# EAGLE design Gamepad Seesaw QT rev A (EAGLE 9.6.2)
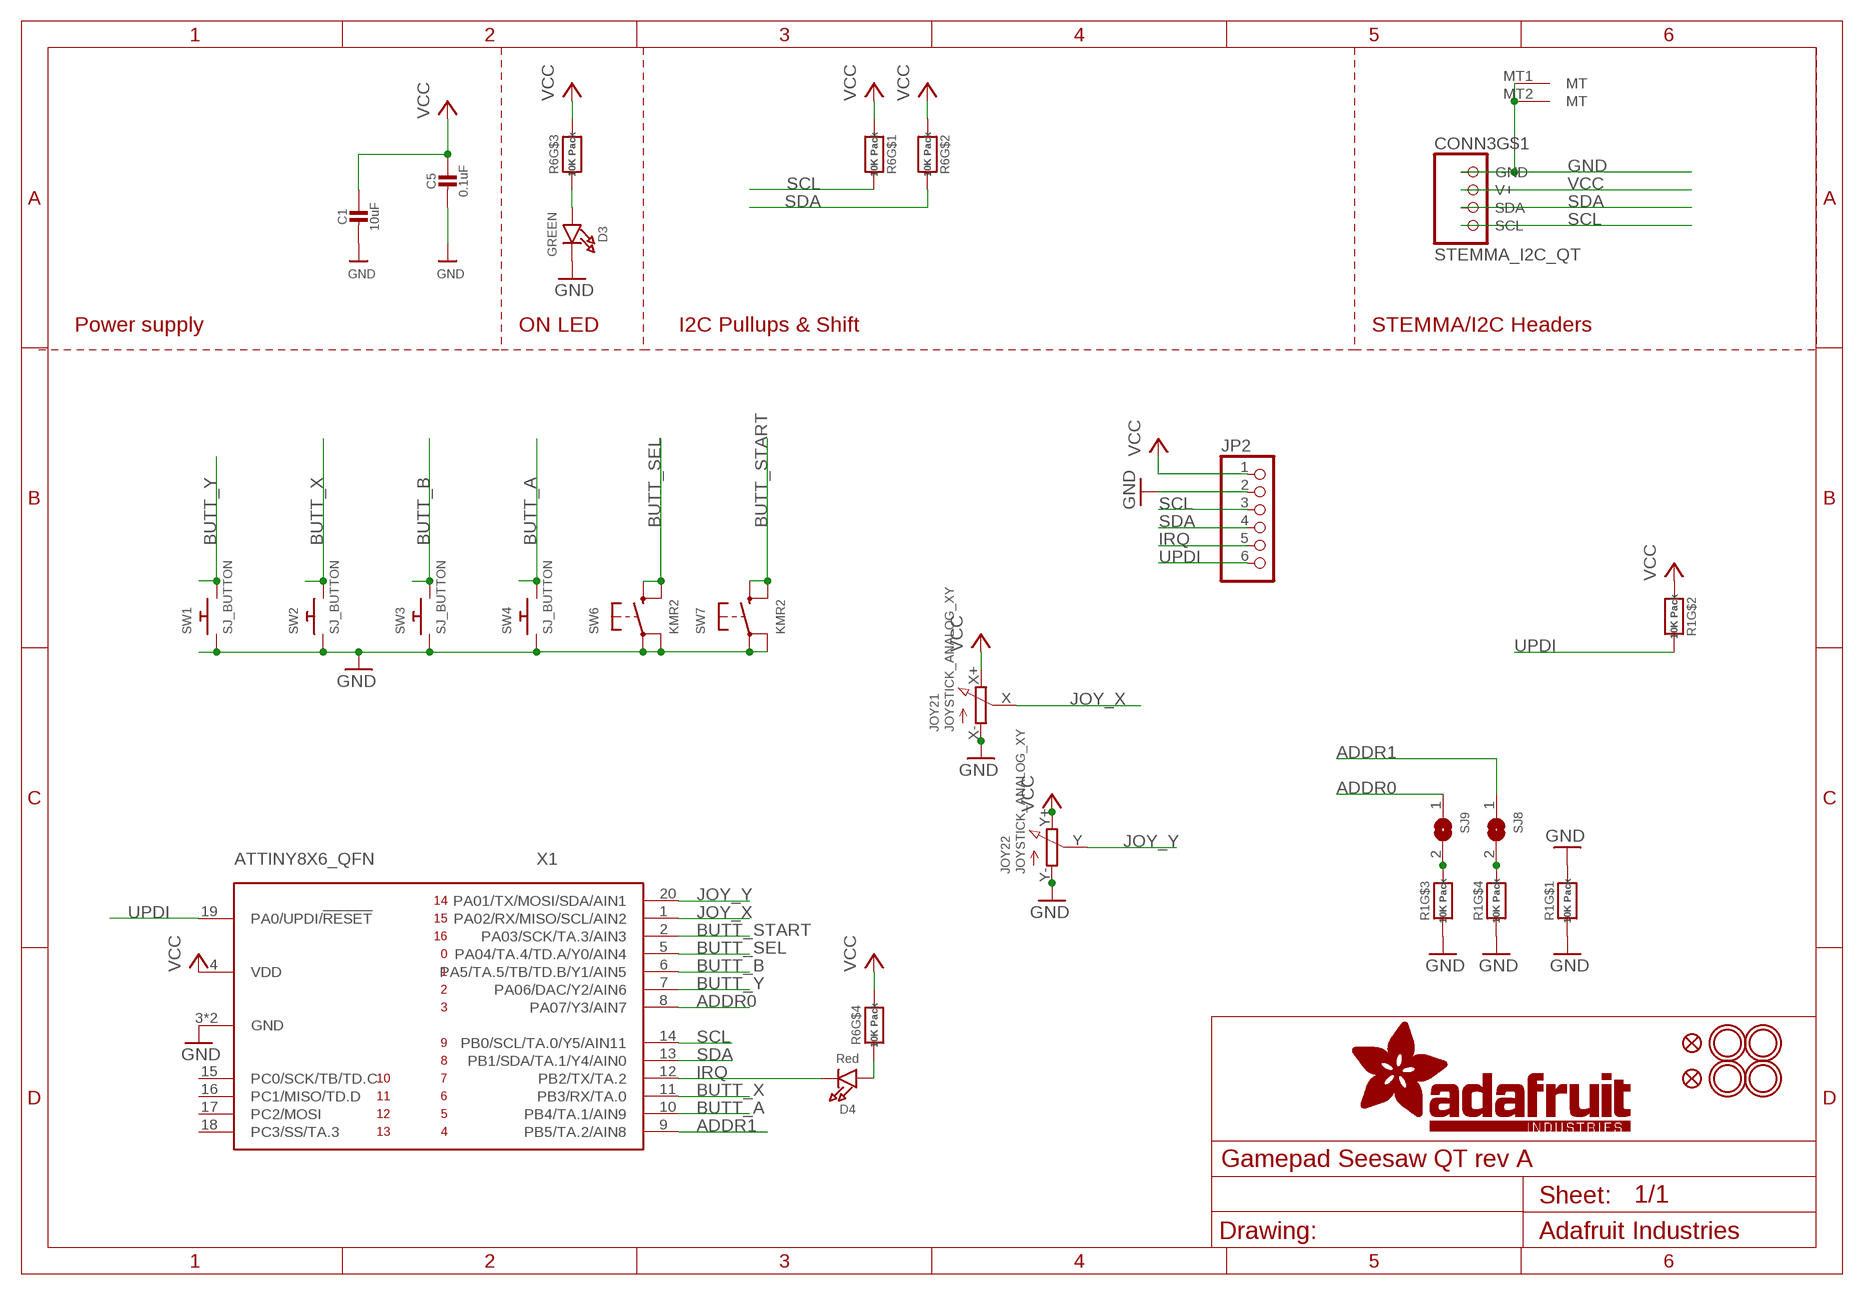
[diagram p0: schematic, sheet 1]

## Parts
C1  10uF  CAP_CERAMIC0805-NOOUTLINE  [0805-NO]
C5  0.1uF  CAP_CERAMIC0603_NO  [0603-NO]
CONN3  STEMMA_I2C_QT  [JST_SH4]
D3  GREEN  LED0603_NOOUTLINE  [CHIPLED_0603_NOOUTLINE]
D4  Red  LED0603_NOOUTLINE  [CHIPLED_0603_NOOUTLINE]
FID1  FIDUCIAL_1MM  [FIDUCIAL_1MM]
FID2  FIDUCIAL_1MM  [FIDUCIAL_1MM]
JOY2  JOYSTICK_ANALOG_XY  [JOYSTICK_ANALOG_MINITHM]
JP2  HEADER-1X6ROUND  [1X06_ROUND]
R1  10K Pack  RESISTOR_4PACK  [RESPACK_4X0603]
R6  10K Pack  RESISTOR_4PACK  [RESPACK_4X0603]
SJ8  SOLDERJUMPERCLOSED  [SOLDERJUMPER_CLOSEDWIRE]
SJ9  SOLDERJUMPERCLOSED  [SOLDERJUMPER_CLOSEDWIRE]
SW1  SJ_BUTTON  SWITCH_PUSHBUTTONSOFTTOUCHSMD_SJ  [PUSHBUTTON_SMD_SJ]
SW2  SJ_BUTTON  SWITCH_PUSHBUTTONSOFTTOUCHSMD_SJ  [PUSHBUTTON_SMD_SJ]
SW3  SJ_BUTTON  SWITCH_PUSHBUTTONSOFTTOUCHSMD_SJ  [PUSHBUTTON_SMD_SJ]
SW4  SJ_BUTTON  SWITCH_PUSHBUTTONSOFTTOUCHSMD_SJ  [PUSHBUTTON_SMD_SJ]
SW6  KMR2  SWITCH_TACT_SMT_RKB2  [BTN_RKB2_4.6X2.8]
SW7  KMR2  SWITCH_TACT_SMT_RKB2  [BTN_RKB2_4.6X2.8]
U$1  MOUNTINGHOLE2.5  [MOUNTINGHOLE_2.5_PLATED]
U$2  MOUNTINGHOLE2.5  [MOUNTINGHOLE_2.5_PLATED]
U$3  MOUNTINGHOLE2.5  [MOUNTINGHOLE_2.5_PLATED]
U$4  MOUNTINGHOLE2.5  [MOUNTINGHOLE_2.5_PLATED]
X1  ATTINY8X6_QFN  [QFN20_3MM]

## Nets
ADDR0: SJ9.1 X1.8(PA07/Y3/AIN7)
ADDR1: SJ8.1 X1.9(PB5/TA.2/AIN8)
BUTT_A: SW4.P$2 X1.10(PB4/TA.1/AIN9)
BUTT_B: SW3.P$2 X1.6(PA5/TA.5/TB/TD.B/Y1/AIN5)
BUTT_SEL: SW6.B'(S1) SW6.B(S) X1.5(PA04/TA.4/TD.A/Y0/AIN4)
BUTT_START: SW7.B'(S1) SW7.B(S) X1.2(PA03/SCK/TA.3/AIN3)
BUTT_X: SW2.P$2 X1.11(PB3/RX/TA.0)
BUTT_Y: SW1.P$2 X1.7(PA06/DAC/Y2/AIN6)
GND: C1.2 C5.2 CONN3.1(GND) CONN3.MT1(MT) CONN3.MT2(MT) D3.C JOY2.X-(1:A) JOY2.Y-(2:A) JP2.2 R1.1 R1.3 R1.4 R1.8 SW1.P$1 SW2.P$1 SW3.P$1 SW4.P$1 SW6.A'(P1) SW6.A(P) SW7.A'(P1) SW7.A(P) X1.3(GND) X1.PAD(GND)
IRQ: D4.C JP2.5 X1.12(PB2/TX/TA.2)
JOY_X: JOY2.X(1:S) X1.1(PA02/RX/MISO/SCL/AIN2)
JOY_Y: JOY2.Y(2:S) X1.20(PA01/TX/MOSI/SDA/AIN1)
N$1: D3.A R6.3
N$2: R1.6 SJ9.2
N$3: R1.5 SJ8.2
N$4: D4.A R6.4
SCL: CONN3.4(SCL) JP2.3 R6.8 X1.14(PB0/SCL/TA.0/Y5/AIN11)
SDA: CONN3.3(SDA) JP2.4 R6.7 X1.13(PB1/SDA/TA.1/Y4/AIN0)
UPDI: JP2.6 R1.7 X1.19(PA0/UPDI/!RESET)
VCC [highpower]: C1.1 C5.1 CONN3.2(V+) JOY2.X+(1:E) JOY2.Y+(2:E) JP2.1 R1.2 R6.1 R6.2 R6.5 R6.6 X1.4(VDD)
Unconnected: X1.15(PC0/SCK/TB/TD.C) X1.16(PC1/MISO/TD.D) X1.17(PC2/MOSI) X1.18(PC3/SS/TA.3)

## Notes on the sheet
- Power supply | ON LED | I2C Pullups & Shift | STEMMA/I2C Headers

## Library data of the parts
C1 C5 = microbuilder:CAP_CERAMIC: Ceramic Capacitors For new designs, use the packages preceded by an '_' character since they are more reliable: The following footprints should be used on most boards: _0402 - Standard footprint for regular board layouts _0603 - Standard footprint for regular board layouts _0805 - Standard footprint for regular board layouts _1206 - Standard footprint for regular board layouts For extremely tight-pitch boards where space is at a premium, the following 'micro-pitch' footprints can be used (smaller pads, no silkscreen outline, etc.): _0402MP - Micro-pitch footprint for very dense/compact boards _0603MP - Micro-pitch footprint for very dense/compact boards _0805MP - Micro-pitch footprint for very dense/compact boards _1206MP - Micro-pitch footprint for very dense/compact boards
CONN3 = adafruit_electromech:STEMMA_I2C; LCSC: C2845363
D3 D4 = microbuilder:LED: LED 0603 - 0603 Surface Mount Package 2mA: Green LED - Low Power (3.9mcd, 2ma, 1.7Vf) - Digikey: 475-2709-2-ND Orange LED - Low Power (9.8mcd, 2ma, 1.8Vf) - Digikey: 475-1194-2-ND Red LED - Low Power (5mcd, 2ma, 1.8Vf) - Digikey: 475-1195-2-ND Yellow LED - Low Power (7mcd, 2ma, 1.8Vf) - Digikey: 475-1196-2-ND 5mA: Blue LED - Low Power (17mcd, 5ma, 2.9Vf) - Digikey: LNJ937W8CRACT-ND 0805 - 0805 Surface Mount Package 2mA: Red LED (8.8mcd, 2mA, 1.8Vf, Clear) - Low Power [Digikey: 475-2510-1-ND] Green LED (5mcd, 2mA, 1.8Vf, Clear) - Low Power [Digikey: 475-2730-1-ND] Yellow LED (11.3mcd, 2mA, 1.8Vf, Clear) - Low Power [Digikey: 475-2555-1-ND] 20mA: Red LED (104mcd, 20mA, Diffused) - LS R976 [Digikey: 475-1278-6-ND] Red LED (12mcd, 20mA, 2.0Vf, Clear) - APT2012EC [Digikey: 754-1128-1-ND] Green LED (15mcd, 20mA, 2.2Vf, Clear) - APT2012GC [Digikey: 754-1131-1-ND] Orange LED (160mcd, 20mA, 2.1Vf, Clear) - APT2012SECK [Digikey: 754-1130-1-ND] 1206 - 1206 Surface Mount Package Green LED (26mcd, 20mA, Diffused) - LG N971 [Digikey: 475-1407-6-ND] Red LED (15mcd, 20mA, Diffused) - LH N974 [Digikey: 475-1416-6-ND] Cree - Cree High-Power Surface Mount LEDs XPEBWT-L1-0000-00D50 - White 111lm 350mA 2.9Vf 6200K 110° XTEAWT-00-0000-00000LEE3 - White 114lm 350mA 2.85Vf 5000K 115° Everlight - Everlight 45-21 Series Surface Mount LEDs 45-21/QK2C-B2832AC2CB2/2T - Warm White 2000mcd 20mA 3.25Vf 3050K 120° 45-21/LK2C-B38452C4CB2/2T - Nuetral White 2000mcd 20mA 3.25Vf 4150K 120° 45-21/LK2C-B50634C6CB2/2T - Cold White 2200mcd 20mA 3.25Vf 5650K 120° PLCC2 Reverse Mount LS T77K-J1L2-1-0-2-R18-Z - Red 11.25mcd 2mA 1.8Vf 630nm 120° LO T77K-L1M2-24-Z - Orange 19.6mcd 2mA 1.8Vf 606nm 120° LY T77K-K2M1-26-Z - Yellow 15.7mcd 2mA 1.8Vf 587nm 120°; ROT: 270
FID1 FID2 = microbuilder:FIDUCIAL: Fiducial Alignment Points Various fiducial points for machine vision alignment.; BOM: EXCLUDE
JOY2 = adafruit_electromech:JOYSTICK_ANALOG_XY
JP2 = microbuilder:HEADER-1X6: PIN HEADER
R1 R6 = microbuilder:RESISTOR_4PACK: Resistor Packs (4 resistors) 4 x 0603 10K 1/16W - Digikey: YC164J-10KCT-ND
SJ8 SJ9 = microbuilder:SOLDERJUMPER: SMD Solder JUMPER Solder the two pads together to create a connection, or remove the solder to break it. REFLOW - Use this footprint for solder paste and reflow ovens. WAVE - Use this footprint for hand-soldering (larger pads). CLOSED - Has a trace between the two pads to ensure it is closed by default. The trace needs to be cut to disable the jumper, and can be closed again by creating a solder bridge between the two pads.
SW1-SW4 = adafruit_electromech:SWITCH_PUSHBUTTON: Buttons SOFTTOUCHSMD_SJ - Soft touch temporary push button (Super Junk Akihabara) Compatible with SKPMANE010 [Mouser: 688-SKPMAN] C&K_KSS = Digikey: KSS221GLFS
SW6 SW7 = adafruit_electromech:SWITCH_TACT_SMT: SMT Tact Switches RKB2 https://www.digikey.com/short/m027prz5
U$1-U$4 = adafruit_electromech:MOUNTINGHOLE: Mounting Hole For #2 screws (0.086"/2.18mm width, 0.094"/2.4mm hole) use 2.5mm; BOM: EXCLUDE
X1 = adafruit_micro:ATTINY8X6

## Net classes
1 highpower: width 0.254 mm, drill 0.483 mm

## Board
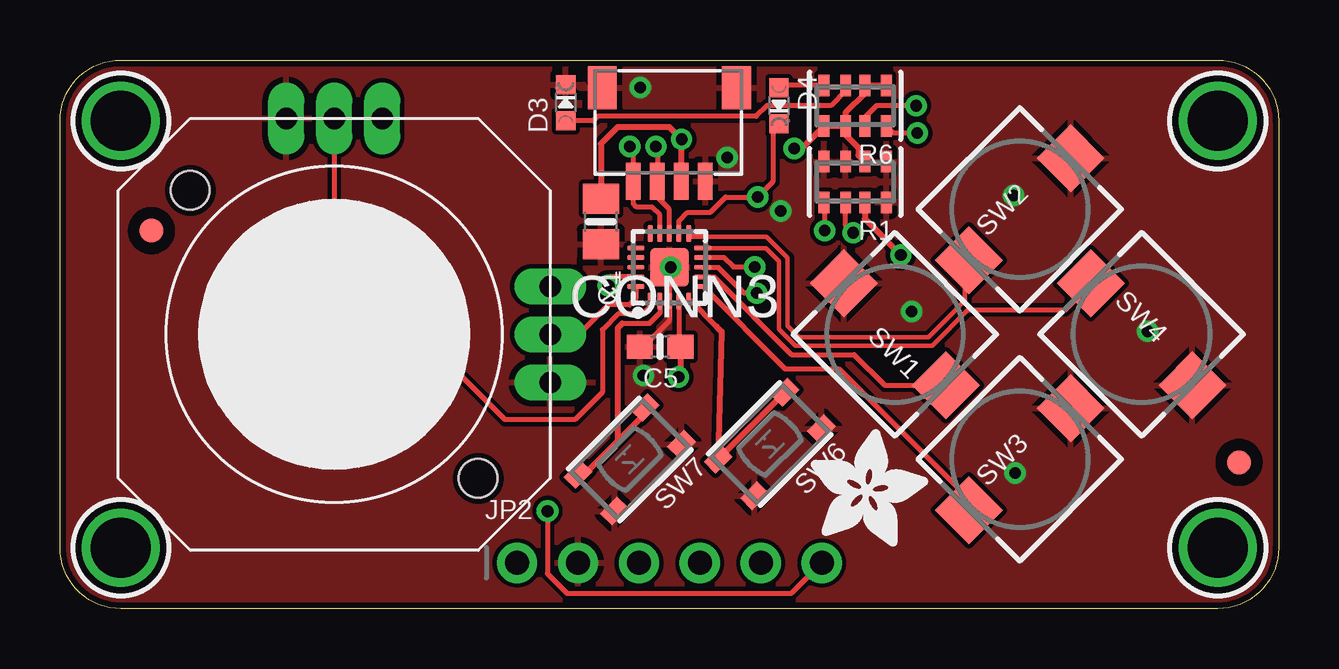
[diagram p1: board, top side]
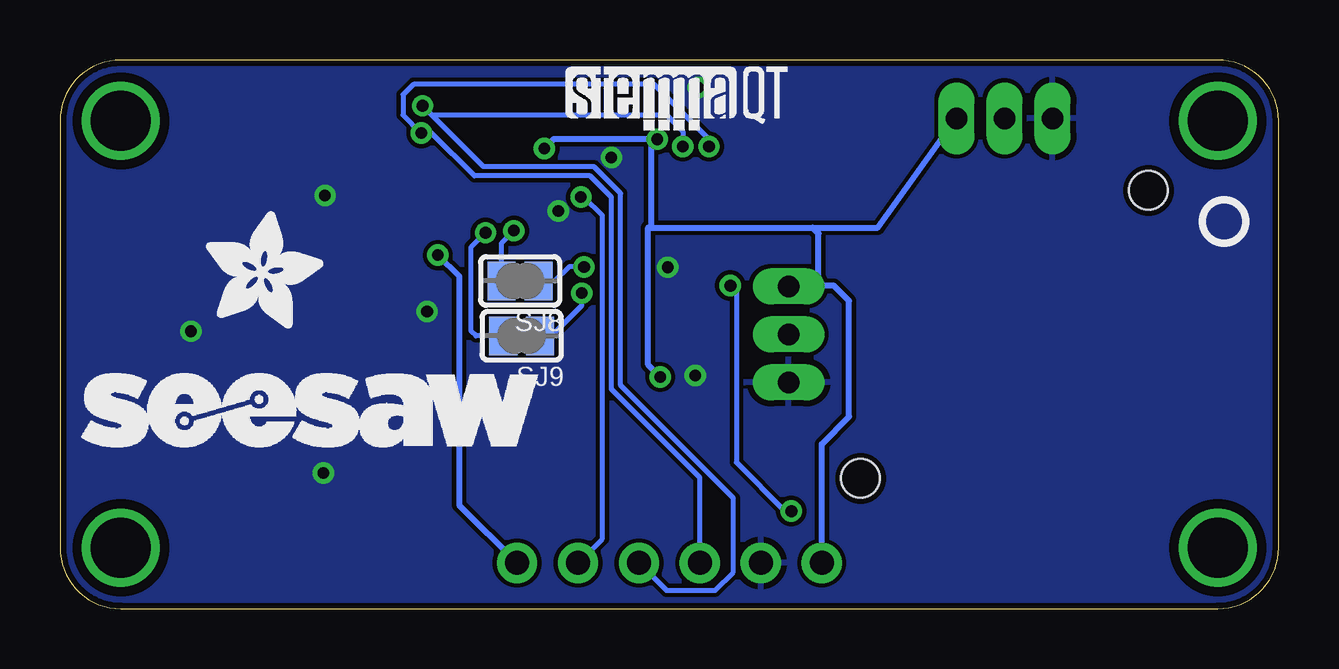
[diagram p2: board, bottom side, seen from below]

Size 50.8 x 22.86 mm. Coordinates in mm from the lower left corner, seen from the top.
Outline: 48.26,0 2.54,0 arc-90 0,2.54 0,20.32 arc-90 2.54,22.86 48.26,22.86 arc-90 50.8,20.32 50.8,2.54 arc-90 48.26,0
Copper layers (1*16): Top 0.035mm / dielectric 1.5mm / Bottom 0.035mm
Design rules "adafruit 7-7": minimum track width 7mil, minimum drill 15.5mil, track to track 7mil, track to pad 7mil, pad to pad 7mil, via to via 7mil, smd to smd 7mil, copper to edge 10mil, drill to drill 8mil, minimum pad ring 7mil, minimum via ring 8mil, stop-mask expansion 2mil, vias tented up to drill 20mil, thermal gap 10mil

### Footprints (pad centres in the part's own frame; a part is rotated, then mirrored left to right if it is on the bottom)
0805-NO = smd 1.24 x 1.5: 1 -0.95,0; 2 0.95,0
0603-NO = smd 1.075 x 1: 1 -0.85,0; 2 0.85,0
JST_SH4 = smd 0.6 x 1.55: 1 -1.5,2.006; 2 -0.5,2.006; 3 0.5,2.006; 4 1.5,2.006 | smd 1.2 x 1.8: MT1 -2.8,-1.894; MT2 2.8,-1.894
CHIPLED_0603_NOOUTLINE = smd 0.8 x 0.8: A 0,-0.75; C 0,0.75
FIDUCIAL_1MM = smd 1 x 1: 1 0,0
JOYSTICK_ANALOG_MINITHM = drill 0.9 pad 1.5 long: X 0,9; X+ 2,9; X- -2,9; Y 9,0; Y+ 9,2; Y- 9,-2 | hole 1.6: -6,6; 6,-6
1X06_ROUND = drill 1 pad 1.676: 1 -6.35,0; 2 -3.81,0; 3 -1.27,0; 4 1.27,0; 5 3.81,0; 6 6.35,0
RESPACK_4X0603 = smd 0.45 x 0.9: 1 -1.3,-0.85; 2 -0.4,-0.85; 3 0.4,-0.85; 4 1.3,-0.85; 5 1.3,0.85; 6 0.4,0.85; 7 -0.4,0.85; 8 -1.3,0.85
SOLDERJUMPER_CLOSEDWIRE = smd 1.168 x 1.6: 1 -0.762,0; 2 0.762,0 | smd 0.635 x 0.203: WIRE 0,0
PUSHBUTTON_SMD_SJ = smd 2 x 2: P$1 3,0; P$2 -3,0
BTN_RKB2_4.6X2.8 = smd 1 x 0.7: A 1.973,1.075; A' -1.973,1.075; B 1.973,-1.075; B' -1.973,-1.075
MOUNTINGHOLE_2.5_PLATED = drill 2.5 pad 3.2: P$1 0,0
QFN20_3MM = smd 0.7 x 0.2: 1 -1.4,0.8; 2 -1.4,0.4; 3 -1.4,0; 4 -1.4,-0.4; 5 -1.4,-0.8; 11 1.4,-0.8; 12 1.4,-0.4; 13 1.4,0; 14 1.4,0.4; 15 1.4,0.8 | smd 0.2 x 0.7: 6 -0.8,-1.4; 7 -0.4,-1.4; 8 0,-1.4; 9 0.4,-1.4; 10 0.8,-1.4; 16 0.8,1.4; 17 0.4,1.4; 18 0,1.4; 19 -0.4,1.4; 20 -0.8,1.4 | smd 1.6 x 1.6: PAD 0,0

### Placement (x,y rotation side)
C1  22.54,16.13 270 top
C5  25.02,10.92 180 top
CONN3  25.4,19.81 180 top
D3  21.08,21.08 0 top
D4  29.97,20.95 180 top
FID1  3.81,15.75 0 top
FID2  49.15,6.1 0 top
JOY2  11.43,11.43 0 top
JP2  25.4,1.91 0 top
PLABEL0  [PLABEL0]  22.23,8.13 45 top
PLABEL1  [PLABEL1]  11.43,1.33 0 top
PLABEL2  [PLABEL2]  28.7,18.67 0 top
PLABEL3  [PLABEL3]  48.9,8.26 0 top
PLABEL4  [PLABEL4]  37.21,1.91 0 top
PLABEL5  [PLABEL5]  43.69,20.32 0 top
PLABEL6  [PLABEL6]  30.99,14.22 0 top
PLABEL7  [PLABEL7]  27.94,8.64 45 top
PLABEL8  [PLABEL8]  33.53,10.6 90 bottom
PLABEL9  [PLABEL9]  33.53,13.08 90 bottom
PLABEL10  [PLABEL10]  16.13,7.49 0 bottom
PLABEL11  [PLABEL11]  21.59,2.98 90 bottom
PLABEL12  [PLABEL12]  19.05,3.11 90 bottom
PLABEL13  [PLABEL13]  31.75,3.11 90 bottom
PLABEL14  [PLABEL14]  29.21,3.11 90 bottom
PLABEL15  [PLABEL15]  26.67,3.11 90 bottom
PLABEL16  [PLABEL16]  24.13,3.11 90 bottom
PLABEL17  [PLABEL17]  16.13,10.92 0 bottom
R1  33.15,17.78 180 top
R6  33.15,20.95 180 top
SJ8  31.62,13.65 180 bottom
SJ9  31.56,11.37 180 bottom
SW1  34.8,11.43 135 top
SW2  40.01,16.64 45 top
SW3  40.01,6.22 45 top
SW4  45.09,11.43 315 top
SW6  29.59,6.86 225 top
SW7  23.75,6.22 225 top
U$1  2.54,20.32 0 top
U$2  2.54,2.54 0 top
U$3  48.26,20.32 0 top
U$4  48.26,2.54 0 top
U$5  [STEMMAQT]  29.72,19.94 0 bottom
U$7  [PCBFEAT-REV-040]  2.29,16.13 0 bottom
U$9  [ADAFRUIT_5MM]  31.31,2.6 0 top
U$11  [ADAFRUIT_5MM]  44.7,11.68 0 bottom
U$12  [SEESAW_LOGO]  49.91,6.73 0 bottom
X1  25.4,14.22 90 top

### Tracks (layer width: path | path; a pad name or v marks a point on that pad's centre or on a via)
ADDR0  (via drill 0.48)
  Top 0.203: v29.05,13.14 28.52,13.14 27.43,14.22 X1.8
  Bottom 0.203: v29.05,13.14 29.05,12.64 30.32,11.37 SJ9.1
ADDR1  (via drill 0.48)
  Top 0.203: v28.96,14.24 28.07,14.24 27.68,14.62 X1.9
  Bottom 0.203: SJ8.1 30.18,13.65 29.59,14.24 v28.96,14.24
BUTT_A
  Top 0.178: X1.10 29.43,15.02 29.97,14.48 29.97,11.63 30.65,10.96 36.35,10.96 37.85,12.45
  Top 0.203: 37.85,12.45 41.91,12.45 42.96,13.5 SW4.P$2
BUTT_B
  Top 0.203: X1.6 30.23,9.99 32.48,9.99 37.88,4.59 37.88,4.45 SW3.P$2 | SW3.P$2
BUTT_SEL
  Top 0.203: 27.37,11.75 26.29,12.82 X1.5
  Top 0.254: 27.37,11.75 27.58,11.54 SW6.B SW6.B'
BUTT_START
  Top 0.203: X1.2 25,12.32 24.55,11.87 23.43,11.87
  Top 0.254: 23.43,11.87 23.24,11.68 23.24,6.97 | SW7.B 21.84,5.83 21.84,5.58 23.24,6.97 | SW7.B' 24.45,8.18 23.24,6.97
BUTT_X
  Top 0.178: 26.92,15.5 29.46,15.5 30.33,14.62 30.33,11.78 30.8,11.31 36.21,11.31 37.48,12.58 37.48,12.6 37.72,12.84 37.72,14.22
  Top 0.203: 26.92,15.5 26.33,15.5 X1.11 | SW2.P$2 37.88,14.39 37.72,14.22
BUTT_Y
  Top 0.203: X1.7 27.26,13.82 30.5,10.59 33.1,10.59 34.38,9.31 SW1.P$2
GND  (via drill 0.48)
  Top 0.203: X1.PAD X1.3 25.4,12 24.32,10.92 C5.2
  other vias: 27.81,18.8 24.32,9.72 39.75,17.21 35.5,12.38 39.81,5.65 45.34,11.56 25.46,14.22 24.19,21.72 30.04,16.57
  pour Top: 0,22.86 0,0 50.8,0 50.8,22.86
  pour Bottom: 0,22.86 0,0 50.8,0 50.8,22.86
IRQ  (via drill 0.48)
  Top 0.203: X1.12 25.8,16.15 26.16,16.51 27.11,16.51 27.75,17.14 v29.08,17.14 29.72,17.78 29.72,19.95 D4.C
  Bottom 0.203: JP2.5 28.19,2.92 28.19,16.38 28.96,17.14 v29.08,17.14
JOY_X
  Top 0.203: X1.1 24.6,12.57 24.31,12.28 23.26,12.28 22.61,11.62 22.61,9.02 21.46,7.87 18.54,7.87 11.43,14.99 JOY2.X
JOY_Y
  Top 0.203: JOY2.Y 21.62,11.43 22.86,12.66 23.75,12.66 24,12.92 X1.20
N$1
  Top 0.203: R6.3 32.75,21.57 32.13,20.95 29.46,20.95 29.02,20.51 22.42,20.51 22.23,20.32 21.09,20.32 D3.A
N$2  (via drill 0.48)
  Top 0.203: v33.06,15.66 32.75,15.98 R1.6
  Bottom 0.203: SJ9.2 33.47,11.37 33.66,11.56 33.66,15.07 v33.06,15.66
N$3  (via drill 0.48)
  Top 0.203: v31.88,15.75 31.88,16.9 R1.5
  Bottom 0.203: SJ8.2 32.38,15.24 v31.88,15.75
N$4
  Top 0.203: R6.4 30.07,21.8 D4.A
SCL  (via drill 0.48)
  Top 0.203: X1.14 25,16.4 24.68,16.73 24.04,16.73 23.9,16.87 CONN3.4 23.9,19.1 v23.75,19.25 | v35.74,19.81 34.74,19.81 R6.8
  Bottom 0.203: v23.75,19.25 23.75,19.56 26.04,21.84 36.07,21.84 36.5,21.41 36.5,20.57 v35.74,19.81 35.31,19.81 33.53,18.03 28.7,18.03 27.81,17.14 27.81,9.14 24.13,5.46 JP2.3
SDA  (via drill 0.48)
  Top 0.203: X1.13 25.4,16.64 24.9,17.14 CONN3.3 24.9,19.19 v24.84,19.25 | v35.69,20.95 34.04,20.95 33.55,20.47 R6.7
  Bottom 0.203: v24.84,19.25 24.84,19.89 25.53,20.57 35.31,20.57 v35.69,20.95 33.15,18.41 28.54,18.41 27.43,17.3 27.43,9.3 22.73,4.6 22.73,1.52 23.5,0.76 25.53,0.76 JP2.4
UPDI  (via drill 0.48, 0.5)
  Top 0.203: X1.19 22.9,13.82 22.86,13.78 v22.86,13.46 | JP2.6 30.48,0.64 21.14,0.64 20.32,1.46 v20.32,4.06
  Top 0.254: R1.7 33.55,16.24 v35.05,14.73
  Bottom 0.203: v22.86,13.46 22.61,13.21 22.61,6.1 20.57,4.06 v20.32,4.06
  Bottom 0.254: v35.05,14.73 34.16,13.84 34.16,4.32 JP2.6
VCC  (via drill 0.48)
  Top 0.203: X1.4 25.8,10.99
  Top 0.254: 25.8,10.99 C5.1 25.87,9.74 v25.78,9.65 | CONN3.2 v25.9,19.55 v25.91,19.56 25.4,20.07 23.24,20.07 22.54,19.37 C1.1 | R6.6 R6.5 30.92,19.18 v30.61,19.18 | R6.1 R6.2 33.55,21.48 32.75,20.68 R6.6 | R6.6 32.75,19.74 33.28,19.21 33.28,18.9 R1.2
  Bottom 0.254: v25.78,9.65 26.29,10.16 26.29,15.88 26.16,15.88 | 26.16,15.88 26.16,19.3 v25.91,19.56 30.23,19.56 v30.61,19.18 | 19.18,13.46 19.18,15.62 19.43,15.88 | 19.18,13.46 19.16,13.46 18.54,13.46 17.91,12.83 17.91,8 19.05,6.86 JP2.1 | 19.18,13.46 JOY2.Y+ | 26.16,15.88 19.43,15.88 | 19.43,15.88 16.71,15.88 JOY2.X+

### Text on the board
Pinguin_tBackup: X | IRQ | Y | Select | Start | A | B | Gamepad QT
Pinguin_bBackup: A1 | A0 | Gamepad / Stemma QT | 2 Axis Joystick / 6 Push Buttons / w/I2C Control | VIN | GND | SCL | SDA | IRQ | UPDI